# EAGLE design digital1 (EAGLE 5.11)
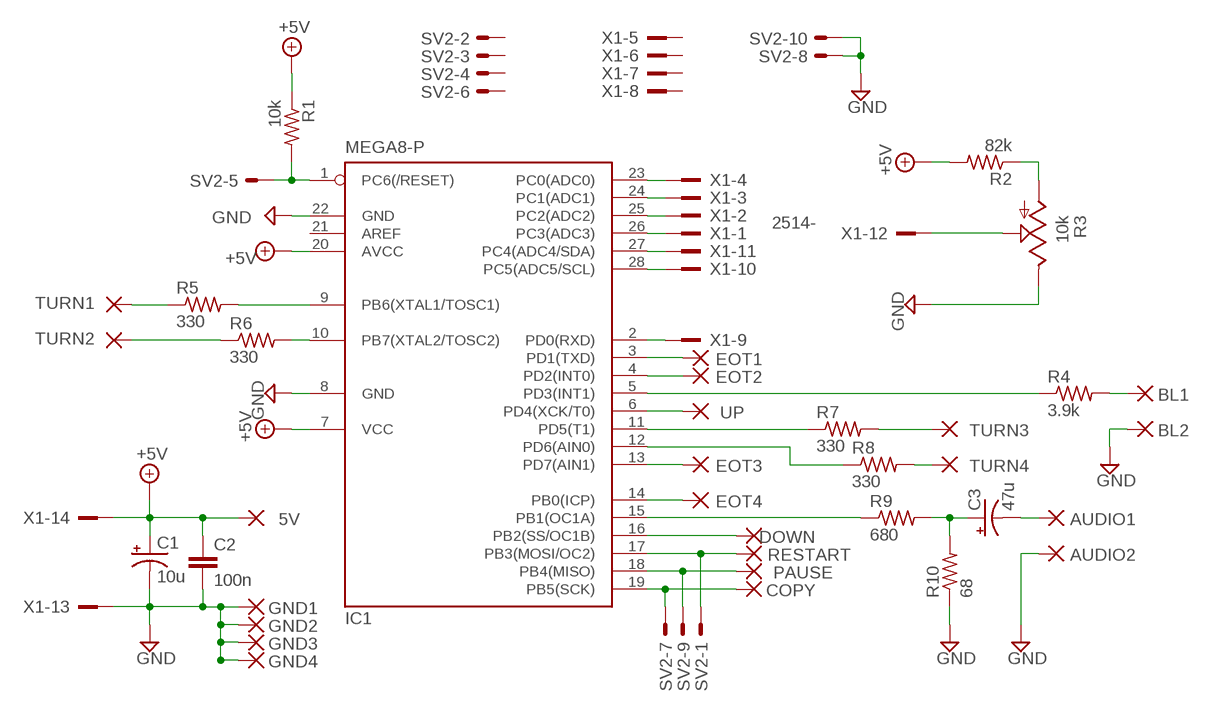
[diagram p0: schematic, sheet 1]

## Parts
5V  2,54/1,0  [2,54/1,0]
AUDIO1  2,54/1,0  [2,54/1,0]
AUDIO2  2,54/1,0  [2,54/1,0]
BL1  2,54/1,0  [2,54/1,0]
BL2  2,54/1,0  [2,54/1,0]
C1  10u  CPOL-USE2-5  [E2-5]
C2  100n  C-EU050-024X044  [C050-024X044]
C3  47u  CPOL-USE2-5  [E2-5]
COPY  2,54/1,0  [2,54/1,0]
DOWN  2,54/1,0  [2,54/1,0]
EOT1  2,54/1,0  [2,54/1,0]
EOT2  2,54/1,0  [2,54/1,0]
EOT3  2,54/1,0  [2,54/1,0]
EOT4  2,54/1,0  [2,54/1,0]
GND1  2,54/1,0  [2,54/1,0]
GND2  2,54/1,0  [2,54/1,0]
GND3  2,54/1,0  [2,54/1,0]
GND4  2,54/1,0  [2,54/1,0]
IC1  MEGA8-P  [DIL28-3]
PAUSE  2,54/1,0  [2,54/1,0]
R1  10k  R-US_0207/15  [0207/15]
R2  82k  R-US_0204/7  [0204/7]
R3  10k  TRIM_US-PT10  [PT-10]
R4  3.9k  R-US_0204/7  [0204/7]
R5  330  R-US_0204/7  [0204/7]
R6  330  R-US_0204/7  [0204/7]
R7  330  R-US_0204/7  [0204/7]
R8  330  R-US_0204/7  [0204/7]
R9  680  R-US_0207/10  [0207/10]
R10  68  R-US_0204/7  [0204/7]
RESTART  2,54/1,0  [2,54/1,0]
SV2  ML10E  [ML10]
TURN1  2,54/1,0  [2,54/1,0]
TURN2  2,54/1,0  [2,54/1,0]
TURN3  2,54/1,0  [2,54/1,0]
TURN4  2,54/1,0  [2,54/1,0]
UP  2,54/1,0  [2,54/1,0]
X1  2514-  [PAK100/2500-14]

## Nets
+5V: 5V.1(P) C1.+ C2.1 IC1.7(VCC) IC1.20(AVCC) R1.1 R2.2 X1.14
GND: AUDIO2.1(P) BL2.1(P) C1.- C2.2 GND1.1(P) GND2.1(P) GND3.1(P) GND4.1(P) IC1.8(GND) IC1.22(GND) R3.E R10.1 SV2.8 SV2.10 X1.13
N$1: COPY.1(P) IC1.19(PB5(SCK)) SV2.7
N$2: IC1.18(PB4(MISO)) PAUSE.1(P) SV2.9
N$3: IC1.1(PC6(/RESET)) R1.2 SV2.5
N$4: IC1.17(PB3(MOSI/OC2)) RESTART.1(P) SV2.1
N$5: EOT2.1(P) IC1.4(PD2(INT0))
N$6: R2.1 R3.A
N$7: EOT1.1(P) IC1.3(PD1(TXD))
N$8: IC1.28(PC5(ADC5/SCL)) X1.10
N$9: IC1.27(PC4(ADC4/SDA)) X1.11
N$10: IC1.26(PC3(ADC3)) X1.1
N$11: IC1.25(PC2(ADC2)) X1.2
N$12: IC1.24(PC1(ADC1)) X1.3
N$13: IC1.23(PC0(ADC0)) X1.4
N$14: IC1.2(PD0(RXD)) X1.9
N$15: IC1.5(PD3(INT1)) R4.1
N$16: BL1.1(P) R4.2
N$17: IC1.6(PD4(XCK/T0)) UP.1(P)
N$18: R5.1 TURN1.1(P)
N$19: IC1.9(PB6(XTAL1/TOSC1)) R5.2
N$20: IC1.10(PB7(XTAL2/TOSC2)) R6.2
N$21: R6.1 TURN2.1(P)
N$22: IC1.11(PD5(T1)) R7.1
N$23: R7.2 TURN3.1(P)
N$24: IC1.12(PD6(AIN0)) R8.1
N$25: R8.2 TURN4.1(P)
N$26: EOT3.1(P) IC1.13(PD7(AIN1))
N$27: EOT4.1(P) IC1.14(PB0(ICP))
N$28: DOWN.1(P) IC1.16(PB2(SS/OC1B))
N$29: AUDIO1.1(P) C3.-
N$30: C3.+ R9.2 R10.2
N$31: IC1.15(PB1(OC1A)) R9.1
N$32: R3.S X1.12
Unconnected: IC1.21(AREF) SV2.2 SV2.3 SV2.4 SV2.6 X1.5 X1.6 X1.7 X1.8

## Library data of the parts
5V AUDIO1 AUDIO2 BL1 BL2 COPY DOWN EOT1-EOT4 GND1-GND4 PAUSE RESTART TURN1-TURN4 UP = wirepad:2,54/1,0: THROUGH-HOLE PAD
C1 C3 = rcl:CPOL-US: POLARIZED CAPACITOR, American symbol
C2 = rcl:C-EU: CAPACITOR, European symbol
IC1 = atmel:MEGA8-P: MICROCONTROLLER 8 Kbytes FLASH, 1 kbytes SRAM, 512 bytes EEPROM, USART, 4-channel 10 bit ADC, 2-channel 8 bit ADC Pin compatible with Atmega48, ATMega88, ATMega168 Source: avr.lbr; OC_FARNELL: unknown; OC_NEWARK: unknown
R1 R2 R4-R10 = rcl:R-US_: RESISTOR, American symbol
R3 = pot:TRIM_US-: POTENTIOMETER
SV2 = con-harting-ml:ML10?E: HARTING; OC_FARNELL: unknown; OC_NEWARK: unknown
X1 = con-3m:2514-: 3M (TM) Pak 100 4-Wall Header Source: 3M; OC_FARNELL: unknown; OC_NEWARK: unknown

## Board
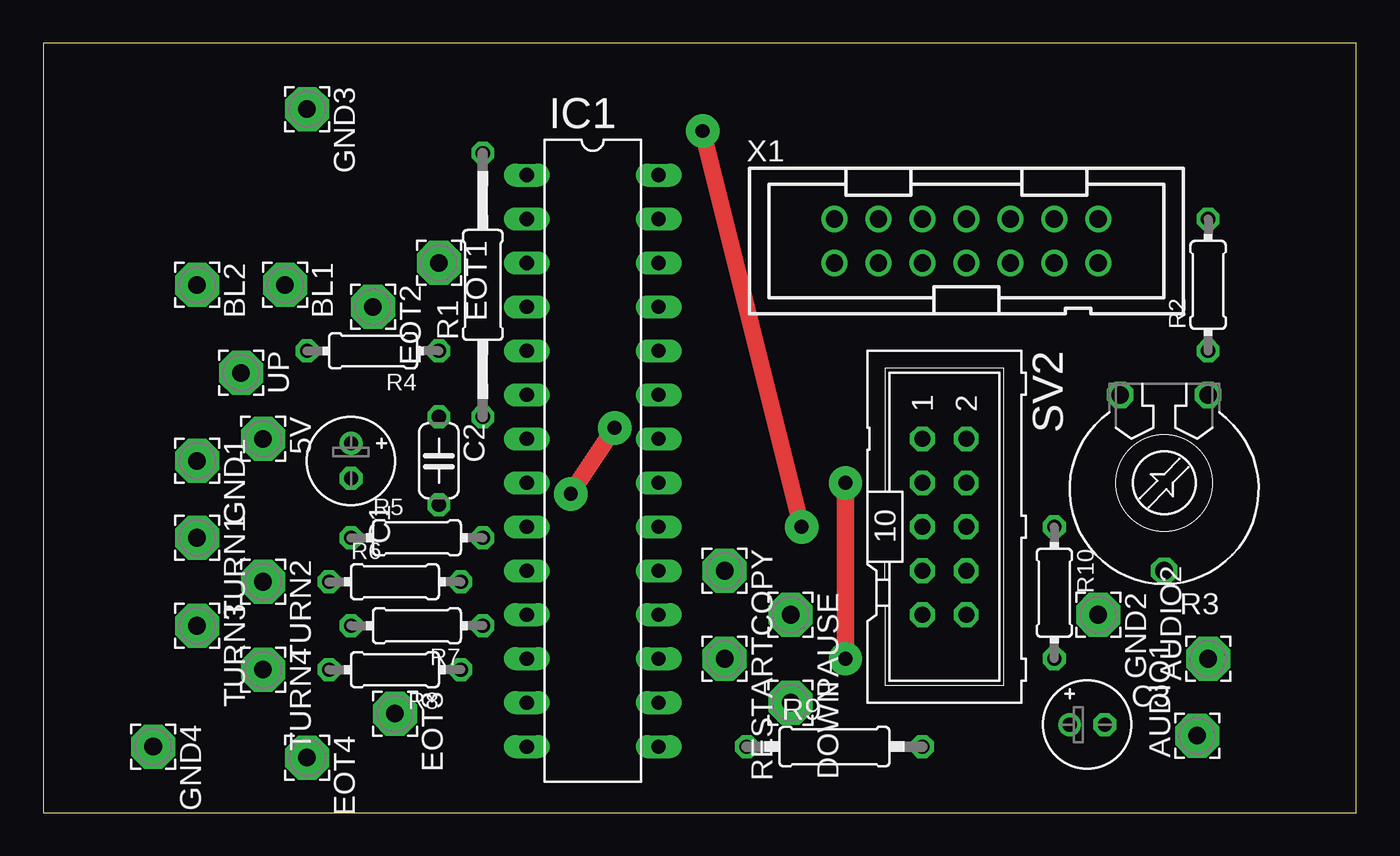
[diagram p1: board, top side]
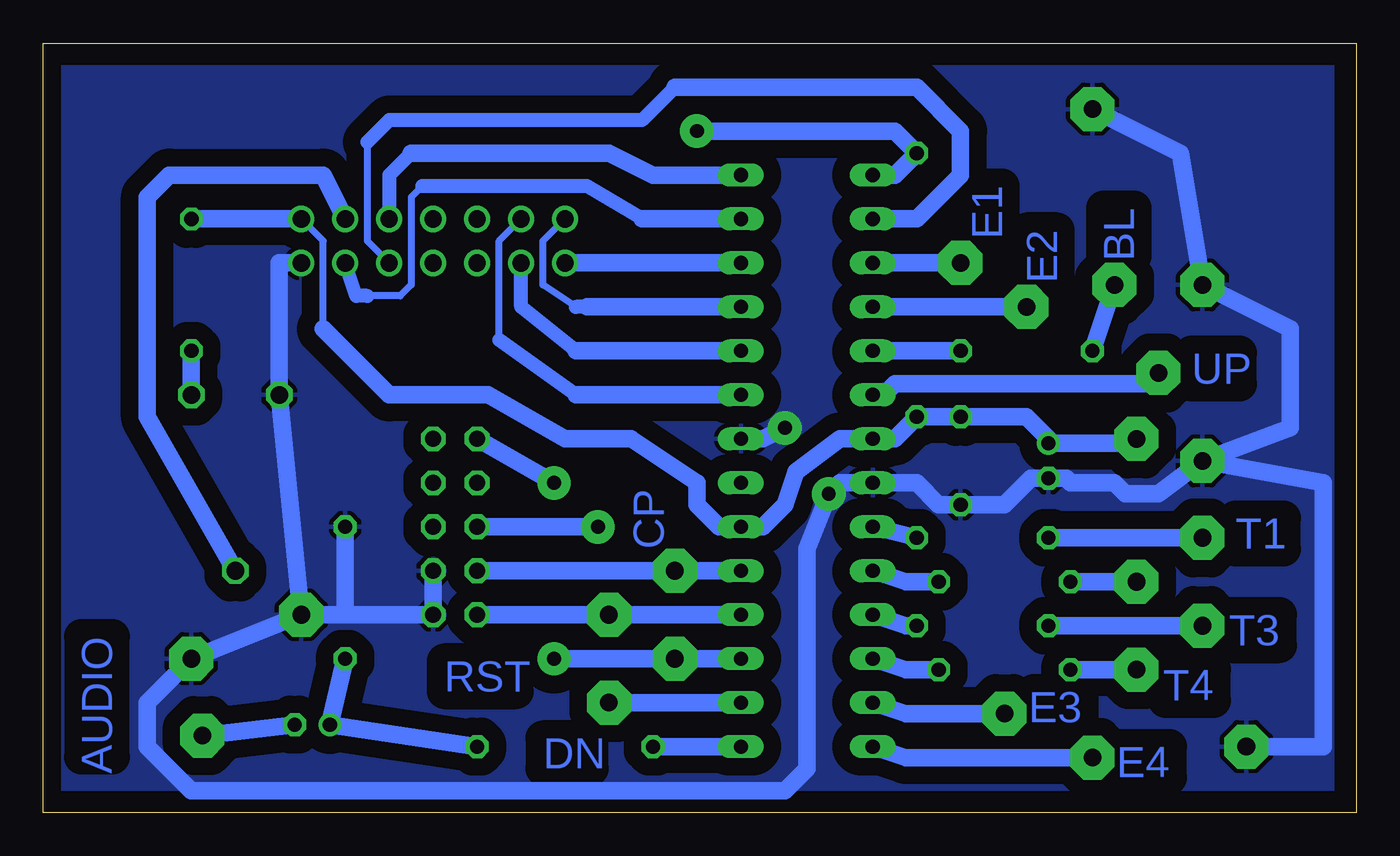
[diagram p2: board, bottom side, seen from below]

Size 75.87 x 44.44 mm. Coordinates in mm from the lower left corner, seen from the top.
Outline: 0,0 75.87,0 75.87,44.44 0,44.44 0,0
Copper layers (1*16): Top 0.035mm / dielectric 1.5mm / Bottom 0.035mm
Design rules "default": minimum track width 10mil, minimum drill 24mil, track to track 8mil, track to pad 8mil, pad to pad 8mil, via to via 8mil, smd to smd 8mil, copper to edge 40mil, drill to drill 8mil, minimum pad ring 10mil, minimum via ring 8mil, stop-mask expansion 4mil, vias tented up to drill 0mil, thermal gap 10mil

### Footprints (pad centres in the part's own frame; a part is rotated, then mirrored left to right if it is on the bottom)
2,54/1,0 = drill 1.016 pad 2.54 octagon: 1 0,0
E2-5 = drill 0.813 pad 1.27 round: + -1.016,0 | drill 0.813 pad 1.27 octagon: - 1.016,0
C050-024X044 = drill 0.813 octagon: 1 -2.54,0; 2 2.54,0
DIL28-3 = drill 0.813 long: 1 -16.51,-3.81; 2 -13.97,-3.81; 3 -11.43,-3.81; 4 -8.89,-3.81; 5 -6.35,-3.81; 6 -3.81,-3.81; 7 -1.27,-3.81; 8 1.27,-3.81; 9 3.81,-3.81; 10 6.35,-3.81; 11 8.89,-3.81; 12 11.43,-3.81; 13 13.97,-3.81; 14 16.51,-3.81; 15 16.51,3.81; 16 13.97,3.81; 17 11.43,3.81; 18 8.89,3.81; 19 6.35,3.81; 20 3.81,3.81; 21 1.27,3.81; 22 -1.27,3.81; 23 -3.81,3.81; 24 -6.35,3.81; 25 -8.89,3.81; 26 -11.43,3.81; 27 -13.97,3.81; 28 -16.51,3.81
0207/15 = drill 0.813 octagon: 1 -7.62,0; 2 7.62,0
0204/7 = drill 0.813 octagon: 1 -3.81,0; 2 3.81,0
PT-10 = drill 1.016 octagon: A -2.54,-5.08; E 2.54,-5.08; S 0,5.08
0207/10 = drill 0.813 octagon: 1 -5.08,0; 2 5.08,0
ML10 = drill 0.914 octagon: 1 -5.08,-1.27; 2 -5.08,1.27; 3 -2.54,-1.27; 4 -2.54,1.27; 5 0,-1.27; 6 0,1.27; 7 2.54,-1.27; 8 2.54,1.27; 9 5.08,-1.27; 10 5.08,1.27
PAK100/2500-14 = drill 1 pad 1.422 round: 1 -7.62,-1.27; 2 -7.62,1.27; 3 -5.08,-1.27; 4 -5.08,1.27; 5 -2.54,-1.27; 6 -2.54,1.27; 7 0,-1.27; 8 0,1.27; 9 2.54,-1.27; 10 2.54,1.27; 11 5.08,-1.27; 12 5.08,1.27; 13 7.62,-1.27; 14 7.62,1.27

### Placement (x,y rotation side)
5V  12.7,21.59 270 top
AUDIO1  66.67,4.45 90 top
AUDIO2  67.31,8.89 90 top
BL1  13.97,30.48 270 top
BL2  8.89,30.48 270 top
C1  17.78,20.32 270 top
C2  22.86,20.32 270 top
C3  60.33,5.08 0 top
COPY  39.37,13.97 270 top
DOWN  43.18,6.35 270 top
EOT1  22.86,31.75 270 top
EOT2  19.05,29.21 270 top
EOT3  20.32,5.71 270 top
EOT4  15.24,3.17 270 top
GND1  8.89,20.32 270 top
GND2  60.96,11.43 270 top
GND3  15.24,40.64 270 top
GND4  6.35,3.81 270 top
IC1  31.75,20.32 270 top
PAUSE  43.18,11.43 270 top
R1  25.4,30.48 90 top
R2  67.31,30.48 90 top
R3  64.77,19.05 180 top
R4  19.05,26.67 180 top
R5  21.59,15.88 0 top
R6  20.32,13.34 0 top
R7  21.59,10.79 180 top
R8  20.32,8.26 180 top
R9  45.72,3.81 0 top
R10  58.42,12.7 270 top
RESTART  39.37,8.89 270 top
SV2  52.07,16.51 270 top
TURN1  8.89,15.88 270 top
TURN2  12.7,13.34 270 top
TURN3  8.89,10.79 270 top
TURN4  12.7,8.26 270 top
UP  11.43,25.4 270 top
X1  53.34,33.02 0 top

### Tracks (layer width: path | path; a pad name or v marks a point on that pad's centre or on a via)
+5V
  Bottom 0.406: 59.69,27.94 59.69,33.02 X1.14
  Bottom 1.016: 5V.1 12.95,21.34 C1.+ 17.78,21.59 19.05,22.86 C2.1 R1.1 26.67,21.59 IC1.7 29.84,21.59 32.38,19.68 33.02,17.78 34.29,16.51 IC1.20 36.83,16.51 38.1,17.78 38.1,19.05 41.91,21.59 45.72,21.59 50.16,24.13 55.88,24.13 59.69,27.94 | X1.14 R2.2
GND  (via drill 0.8 pad 1.93)
  Top 1.016: v30.48,18.41 v33.02,22.23
  Bottom 1.016: SV2.8 SV2.10 58.42,11.43 | X1.13 62.23,31.75 R3.E GND2.1 | IC1.22 34.29,21.59 v33.02,22.23 | GND1.1 11.43,18.41 13.34,18.41 13.97,19.05 16.51,19.05 16.76,19.3 C1.- 18.8,19.3 20.32,17.78 C2.2 24.13,17.78 25.4,19.05 IC1.8 29.84,19.05 v30.48,18.41 31.75,15.24 31.75,2.54 33.02,1.27 67.31,1.27 69.85,3.81 69.85,6.35 AUDIO2.1 GND2.1 | GND3.1 10.16,38.1 BL2.1 3.81,27.94 3.81,22.23 GND1.1 | GND1.1 1.91,19.05 1.91,3.81 GND4.1 | GND2.1 58.42,11.43 | 58.42,11.43 R10.1
  pour Bottom (isolate 1.016): 1.27,43.18 74.93,43.18 74.93,1.27 1.27,1.27
N$1
  Bottom 1.016: IC1.19 COPY.1 SV2.7
N$2
  Bottom 1.016: IC1.18 PAUSE.1 SV2.9
N$3  (via drill 0.8 pad 1.93)
  Top 1.016: v43.81,16.51 v38.1,39.37
  Bottom 1.016: v43.81,16.51 SV2.5 | v38.1,39.37 26.67,39.37 R1.2 26.67,36.83 IC1.1
N$4  (via drill 0.8 pad 1.93)
  Top 1.016: v46.35,8.89 v46.35,19.05
  Bottom 1.016: IC1.17 RESTART.1 v46.35,8.89 | v46.35,19.05 SV2.1
N$5
  Bottom 1.016: EOT2.1 IC1.4
N$6
  Bottom 1.016: R3.A R2.1
N$7
  Bottom 1.016: EOT1.1 IC1.3
N$8
  Bottom 0.813: 54.61,38.1 55.88,36.83 X1.10
  Bottom 1.016: IC1.28 40.64,36.83 43.18,38.1 54.61,38.1
N$9
  Bottom 0.406: 53.98,36.2 54.61,35.56 54.61,30.48 55.24,29.84 57.15,29.84
  Bottom 0.813: 41.27,34.29 44.45,36.2 53.98,36.2 | 57.15,29.84 57.78,29.84 X1.11
  Bottom 1.016: IC1.27 41.27,34.29
N$10
  Bottom 1.016: IC1.26 X1.1
N$11
  Bottom 0.406: 45.09,29.21 46.99,30.48 46.99,33.02 X1.2
  Bottom 0.813: 44.45,29.21 45.09,29.21
  Bottom 1.016: IC1.25 44.45,29.21
N$12
  Bottom 0.813: 45.09,26.67 48.26,29.21 X1.3
  Bottom 1.016: IC1.24 45.09,26.67
N$13
  Bottom 0.406: 49.53,27.3 49.53,33.02 X1.4
  Bottom 0.813: 45.09,24.13 49.53,27.3
  Bottom 1.016: IC1.23 45.09,24.13
N$14
  Bottom 0.406: 57.15,38.73 57.15,33.02 X1.9
  Bottom 0.813: 39.37,41.91 41.27,40.01 55.88,40.01 57.15,38.73
  Bottom 1.016: IC1.2 25.4,34.29 22.86,36.83 22.86,39.37 25.4,41.91 39.37,41.91
N$15
  Bottom 1.016: R4.1 IC1.5
N$16
  Bottom 1.016: R4.2 BL1.1
N$17
  Bottom 1.016: IC1.6 27.3,24.13 26.67,24.77 12.06,24.77 UP.1
N$18
  Bottom 1.016: TURN1.1 R5.1
N$19
  Bottom 1.016: R5.2 IC1.9
N$20
  Bottom 1.016: IC1.10 26.04,13.34 R6.2
N$21
  Bottom 1.016: TURN2.1 R6.1
N$22
  Bottom 1.016: IC1.11 26.04,10.79 R7.1
N$23
  Bottom 1.016: TURN3.1 R7.2
N$24
  Bottom 1.016: IC1.12 26.04,8.26 R8.1
N$25
  Bottom 1.016: TURN4.1 R8.2
N$26
  Bottom 1.016: IC1.13 26.04,5.71 EOT3.1
N$27
  Bottom 1.016: IC1.14 26.04,3.17 EOT4.1
N$28
  Bottom 1.016: IC1.16 DOWN.1
N$29
  Bottom 1.016: C3.- AUDIO1.1
N$30
  Bottom 1.016: R9.2 C3.+ R10.2
N$31
  Bottom 1.016: IC1.15 R9.1
N$32
  Bottom 1.016: X1.12 59.69,36.83 68.58,36.83 69.85,35.56 69.85,22.86 R3.S

### Text on the board
Bottom: E1 | BL | E2 | UP | T1 | CP | T3 | AUDIO | T4 | E3 | RST | E4 | DN